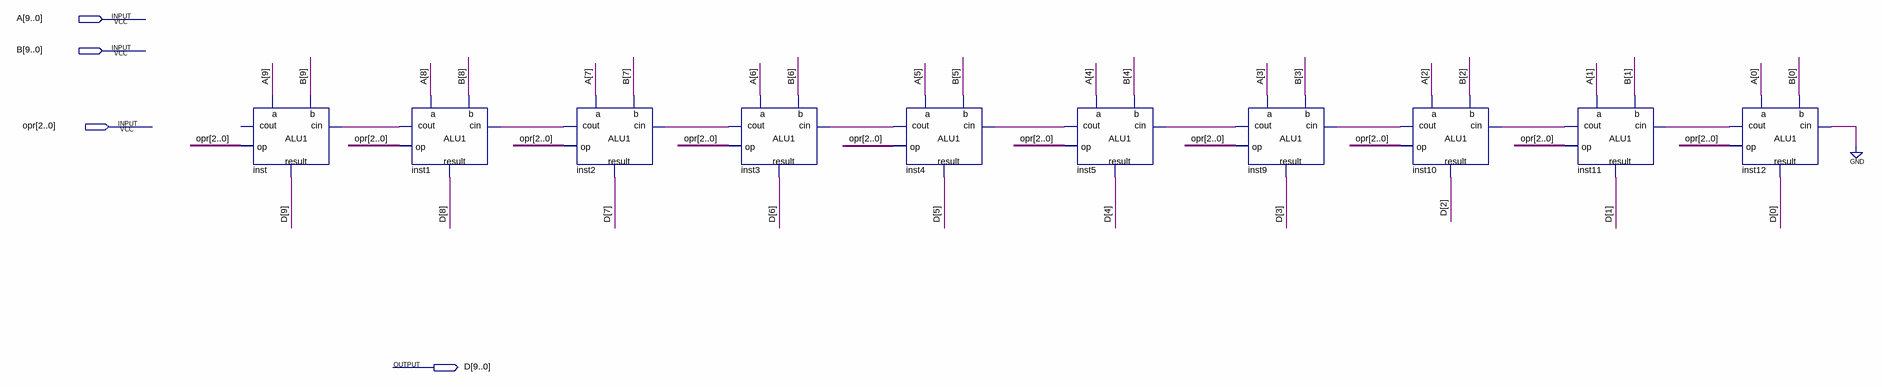
[diagram p0: schematic sheet]
// Quartus schematic ALU10.bdf as structural Verilog: 10 symbols, 4 pins
module ALU10 (
  input  [9:0] A,
  input  [9:0] B,
  input  [2:0] opr,
  output [9:0] D
);

  wire inst1_cout, inst2_cout, inst3_cout, inst4_cout, inst5_cout, inst9_cout, inst10_cout, inst11_cout,
       inst12_cout;

  ALU1 inst (.a(A[9]), .b(B[9]), .cin(inst1_cout), .op(opr), .result(D[9]));  // open: cout
  ALU1 inst1 (.a(A[8]), .b(B[8]), .cin(inst2_cout), .op(opr), .cout(inst1_cout), .result(D[8]));
  ALU1 inst2 (.a(A[7]), .b(B[7]), .cin(inst3_cout), .op(opr), .cout(inst2_cout), .result(D[7]));
  ALU1 inst3 (.a(A[6]), .b(B[6]), .cin(inst4_cout), .op(opr), .cout(inst3_cout), .result(D[6]));
  ALU1 inst4 (.a(A[5]), .b(B[5]), .cin(inst5_cout), .op(opr), .cout(inst4_cout), .result(D[5]));
  ALU1 inst5 (.a(A[4]), .b(B[4]), .cin(inst9_cout), .op(opr), .cout(inst5_cout), .result(D[4]));
  ALU1 inst9 (.a(A[3]), .b(B[3]), .cin(inst10_cout), .op(opr), .cout(inst9_cout), .result(D[3]));
  ALU1 inst10 (.a(A[2]), .b(B[2]), .cin(inst11_cout), .op(opr), .cout(inst10_cout), .result(D[2]));
  ALU1 inst11 (.a(A[1]), .b(B[1]), .cin(inst12_cout), .op(opr), .cout(inst11_cout), .result(D[1]));
  ALU1 inst12 (.a(A[0]), .b(B[0]), .cin(1'b0), .op(opr), .cout(inst12_cout), .result(D[0]));
endmodule
